# Altium schematic sheet ORelay.SchDoc
size A4
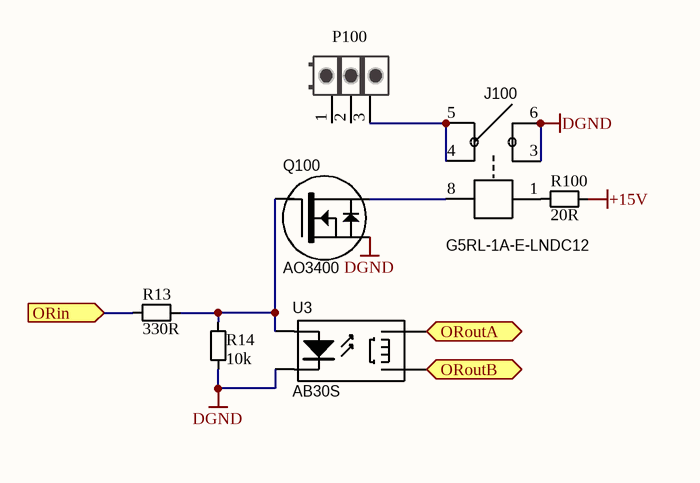
[diagram p0: ORelay.SchDoc]

## Parts
J100  G5RL-1A-E-LNDC12  [G5RL-1A-E]
P100  KF7.62-3P  [KF762-3]  (value not drawn)
Q100  AO3400  [SOT-23_N]
R13  value 330R  [0603-R]  (hidden comment: Res)
R14  value 10k  [0603-R]  (hidden comment: Res)
R100  value 20R  [1206-R]  (hidden comment: Res)
U3  AB30S  [TOWARD-SOP-4]

## Ports
ORin (in), ORoutA (out), ORoutB (out)

## Nets
+15V: R100.2
DGND: J100.3 J100.6 Q100.2(S) R14.2 U3.2(K)
ORin: R13.1 ; port ORin
ORoutA: U3.4(C) ; port ORoutA
ORoutB: U3.3(E) ; port ORoutB
NetJ100_1: J100.1 R100.1
NetJ100_4: J100.4 J100.5 P100.3
NetJ100_8: J100.8 Q100.3(D)
NetQ100_1: Q100.1(G) R13.2 R14.1 U3.1(A)

Not connected (* = marked no-connect by the designer): P100 1 2

## Library data of the parts
J100 = JNDZG5RL1122: Power/Signal Relay G5RL-1A-E-LNDC12 16A 250VAC 12VDC; Manufacturer: OMRON; TemperatureRange: -40 to 70°C; MountType: DIP; PackageReference: G5RL-1A-E; Published: 1-Jun-2017; Publisher: GreenBox; VenderID: G5RL-1A-E-LNDC12
P100 = PKDK03Z76200: Header KF7.62-3P 7.62mm; Publisher: GreenBox; Published: 1-Jan-2017; MountType: DIP; PackageReference: KF7.62-3P; VenderID: KF7.62-3P; TemperatureRange: *
Q100 = QN42AO34000A: N-Channel MOSFET AO3400 30V 5.8A; Manufacturer: ALPHA&OMEGA; TemperatureRange: -55 to 150°C; MountType: SMT; PackageReference: SOT-23; Published: 1-Jun-2017; Publisher: GreenBox; VenderID: AO3400
R13 = R11C330RFBF0: SMD Resistor 330R 1% 1/10W 0603 100PPM; TemperatureRange: -55°C to 150°C; VenderID: RES-0603-330R-1%; Published: 1-Jun-2017; Publisher: GreenBox; MountType: SMT; PackageReference: 0603; Manufacturer: *
R14 = R11C010KFBF0: SMD Resistor 10k 1% 1/10W 0603 100PPM; TemperatureRange: -55°C to 150°C; VenderID: RES-0603-10k-1%; Published: 1-Jun-2017; Publisher: GreenBox; MountType: SMT; PackageReference: 0603; Manufacturer: *
R100 = R11E020RFDF0: SMD Resistor 20R 1% 1/4W 1206 100PPM; TemperatureRange: -55°C to 150°C; VenderID: RES-1206-20R-1%; Published: 1-Jun-2017; Publisher: GreenBox; MountType: SMT; PackageReference: 1206; Manufacturer: *
U3 = UPSCAB30S00W: Solid State Optronics Relay AB30S 100mA 400V 24Ω; Manufacturer: TOWARD; TemperatureRange: -40°C to 85°C; MountType: SMT; PackageDescription: SOP-4 Pitch 2.54mm; PackageReference: TOWARD-SOP-4; Published: 1-Jun-2017; Publisher: GreenBox; VenderID: AB30S